# Altium project transistor_harness.PrjPCB
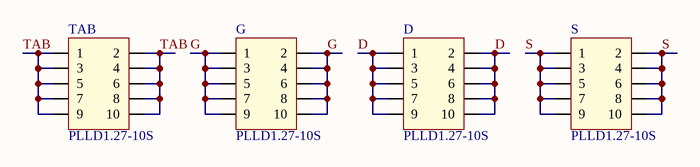
[diagram p0: Main.SchDoc]
1 sheet, 4 parts. Net scope: global (net labels, ports and power ports of the same name join across sheets).
Board file: transistor_harness.PcbDoc

## Sheet Main.SchDoc: SEB/SEGR Parry Dev. Transistor mnt.
size A4; ApprovedBy: N/A; CheckedBy: N/A; Author: BPS; CompanyName: N/A; DrawnBy: BPS; Engineer: BOS; Organization: N/A; Address1: N/A; Address2: N/A; Address3: N/A; Address4: N/A; DocumentNumber: SSP-04; Revision: A; SheetNumber: 1; SheetTotal: 1; Application_BuildNumber: 1

### Parts
D  PLLD1.27-10S  [PLLD1.27-10S]
G  PLLD1.27-10S  [PLLD1.27-10S]
S  PLLD1.27-10S  [PLLD1.27-10S]
TAB  PLLD1.27-10S  [PLLD1.27-10S]

### Nets
D: D.1 D.2 D.3 D.4 D.5 D.6 D.7 D.8 D.9 D.10
G: G.1 G.2 G.3 G.4 G.5 G.6 G.7 G.8 G.9 G.10
S: S.1 S.2 S.3 S.4 S.5 S.6 S.7 S.8 S.9 S.10
TAB: TAB.1 TAB.2 TAB.3 TAB.4 TAB.5 TAB.6 TAB.7 TAB.8 TAB.9 TAB.10

### Notes on the sheet
- Title
- Size:
- Date:
- A4
- Number:
- Time:
- Revision:
- Sheet
- of
- File:

### Library data of the parts
D G S TAB = PLLD1.27-10S: System: Connector